# EasyEDA Pro project full_pcb_files.epro, schematic Schematic2
Board Name: protoboard; Create Date: 2025-07-08; Page Name: P1; Project Name: rocketpcb; Schematic Name: Schematic2; Company: EasyEDA.com; Page Size: A4; Version: V1.0
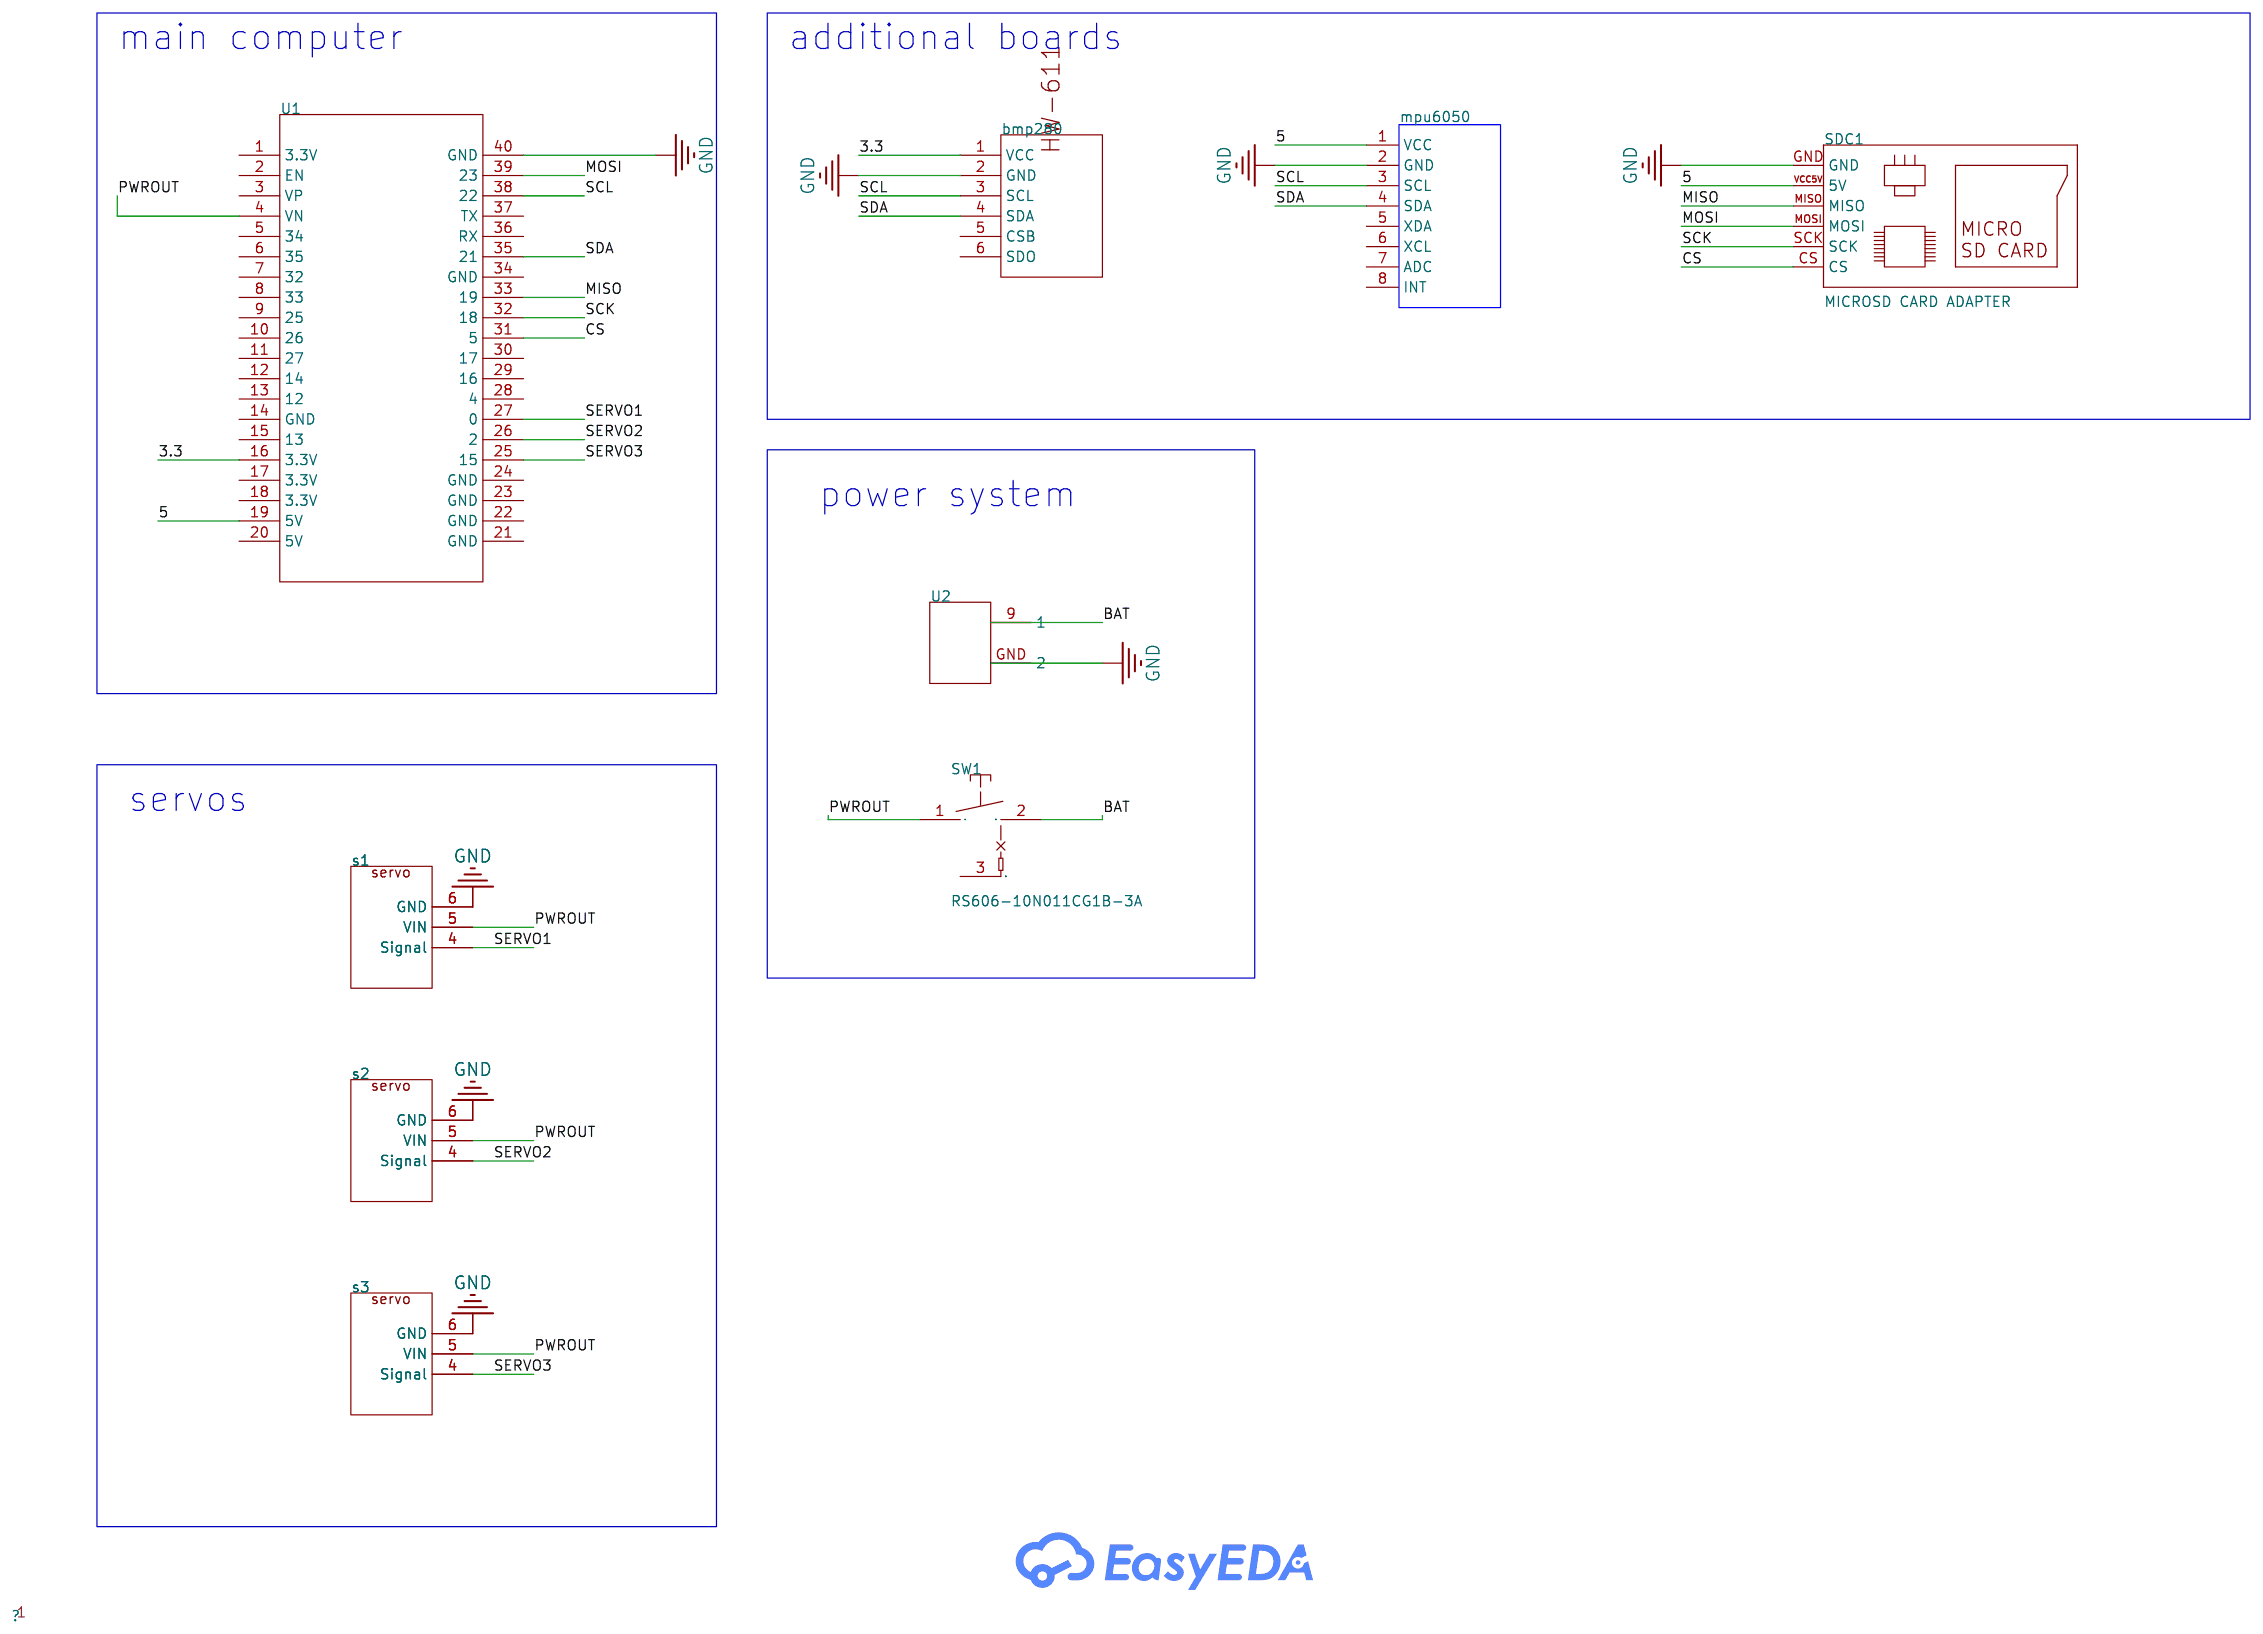
[diagram p0: schematic sheet]

## Parts
bmp280  -  [HW-611 (BME/BMP280)]
mpu6050  -  [GY-521]
s1  -  [servo]
s2  -  [servo]
s3  -  [servo]
SDC1  MICROSD CARD ADAPTER  [MICRO-SD-CARD-ADAPTER]
SW1  RS606-10N011CG1B-3A  [SW-TH_RS606-101N011CRB]
U1  -  [Freenove ESP32 WROOM]
U2  -  [12vto5vfootprint]

## Library data of the parts
bmp280 = HW-611 Temperature Barometer Humidity Module (BMP/BME280, 3V3, 6 pins): 6-pin; 3V3 Modul; Manufacturer Part: MPU-6050
mpu6050 = GY-521
s1-s3 = servopins
SDC1 = MICROSD CARD ADAPTER
SW1 = RS606-10N011CG1B-3A: Length:30.5mm Width:13.5mm Switch Height:21.6mm Actuator Type:Concave Bend With Lamp:- Termination Style:PC Pin Actuator Color:Green Current Rating:6A Voltage Rating (AC):250V Voltage Rating (DC):- Circuit:SPST Life:10,000 Cycles Operating Temperature:-25; Supplier Part: C2885789; Manufacturer: HCTL(华灿天禄); Supplier Footprint: 插件; JLCPCB Part Class: Extended Part; Datasheet: https://atta.szlcsc.com/upload/public/pdf/source/20210820/595D0B24FF31A1D6FF5148E20784BF1D.pdf; Supplier: LCSC; Length: 30.5mm; Width: 13.5mm; Switch Height: 21.6mm; Actuator Type: Concave Bend; Termination Style: PC Pin; Actuator Color: Green; Current Rating: 6A; Voltage Rating (AC): 250V; Circuit: SPST; Life: 10,000 Cycles; Operating Temperature: -25℃~+85℃; Actuator Identifier: - O
